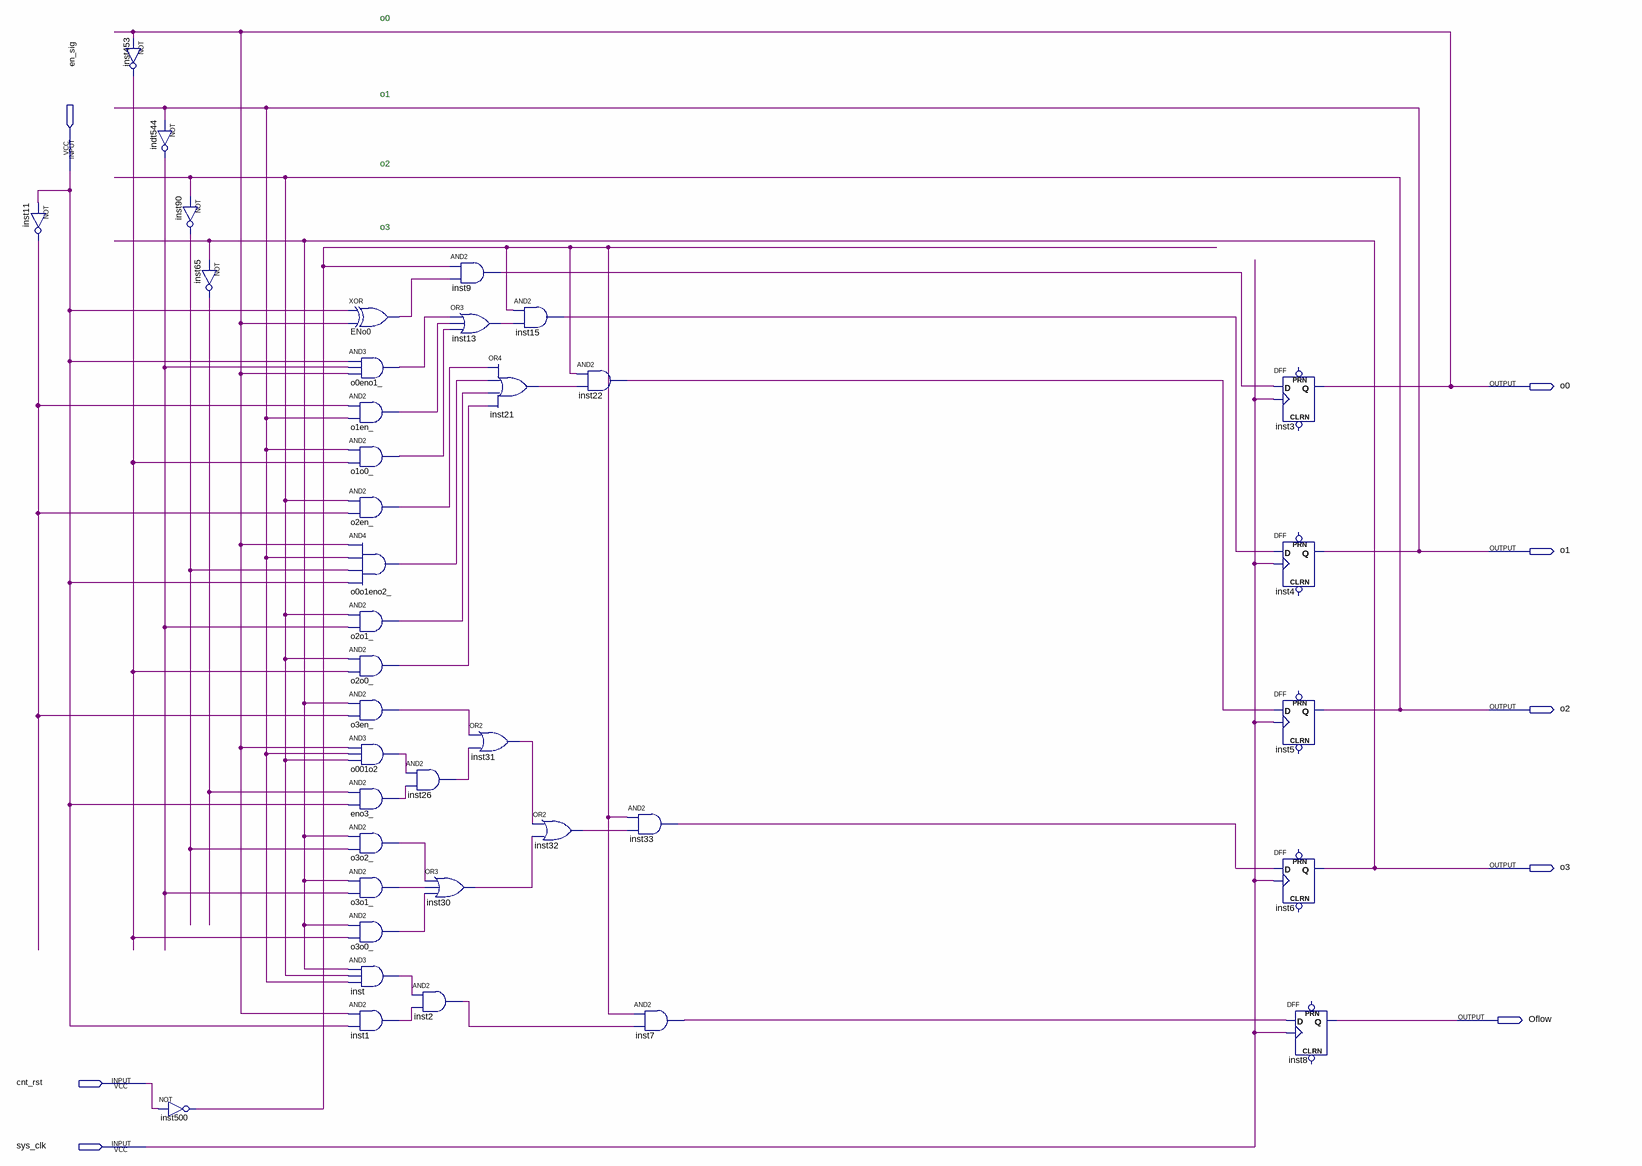
[diagram p0: schematic sheet]
// Quartus schematic counter.bdf as structural Verilog: 39 symbols, 8 pins
module counter (
  input  en_sig,
  input  cnt_rst,
  input  sys_clk,
  output o0,
  output o1,
  output o2,
  output o3,
  output Oflow
);

  wire ENo0_out, eno3__out, indt544_out, inst1_out, inst2_out, inst7_out, inst9_out, inst11_out, inst13_out,
       inst15_out, inst21_out, inst22_out, inst26_out, inst30_out, inst31_out, inst32_out, inst33_out,
       inst65_out, inst90_out, inst453_out, inst500_out, inst_out, o0eno1__out, o0o1eno2__out, o1en__out,
       o1o0__out, o001o2_out, o2en__out, o2o0__out, o2o1__out, o3en__out, o3o0__out, o3o1__out, o3o2__out;

  not inst11 (inst11_out, en_sig);
  not inst453 (inst453_out, o0);
  not indt544 (indt544_out, o1);
  not inst500 (inst500_out, cnt_rst);
  not inst90 (inst90_out, o2);
  not inst65 (inst65_out, o3);
  xor ENo0 (ENo0_out, en_sig, o0);
  and o0eno1_ (o0eno1__out, en_sig, indt544_out, o0);
  and o1en_ (o1en__out, inst11_out, o1);
  and o1o0_ (o1o0__out, o1, inst453_out);
  and o2en_ (o2en__out, o2, inst11_out);
  and o0o1eno2_ (o0o1eno2__out, o0, o1, inst90_out, en_sig);
  and o2o1_ (o2o1__out, o2, indt544_out);
  and o2o0_ (o2o0__out, o2, inst453_out);
  and o3en_ (o3en__out, o3, inst11_out);
  and o001o2 (o001o2_out, o0, o1, o2);
  and eno3_ (eno3__out, inst65_out, en_sig);
  and o3o2_ (o3o2__out, o3, inst90_out);
  and o3o1_ (o3o1__out, o3, indt544_out);
  and o3o0_ (o3o0__out, o3, inst453_out);
  and inst (inst_out, o3, o2, o1);
  and inst1 (inst1_out, o0, en_sig);
  and inst26 (inst26_out, o001o2_out, eno3__out);
  and inst2 (inst2_out, inst_out, inst1_out);
  and inst9 (inst9_out, inst500_out, ENo0_out);
  or inst13 (inst13_out, o0eno1__out, o1en__out, o1o0__out);
  or inst30 (inst30_out, o3o2__out, o3o1__out, o3o0__out);
  and inst15 (inst15_out, inst500_out, inst13_out);
  or inst21 (inst21_out, o2en__out, o0o1eno2__out, o2o1__out, o2o0__out);
  or inst31 (inst31_out, o3en__out, inst26_out);
  or inst32 (inst32_out, inst31_out, inst30_out);
  and inst22 (inst22_out, inst500_out, inst21_out);
  and inst33 (inst33_out, inst500_out, inst32_out);
  and inst7 (inst7_out, inst500_out, inst2_out);
  DFF inst3 (.CLK(sys_clk), .D(inst9_out), .Q(o0));  // open: CLRN, PRN
  DFF inst4 (.CLK(sys_clk), .D(inst15_out), .Q(o1));  // open: CLRN, PRN
  DFF inst5 (.CLK(sys_clk), .D(inst22_out), .Q(o2));  // open: CLRN, PRN
  DFF inst6 (.CLK(sys_clk), .D(inst33_out), .Q(o3));  // open: CLRN, PRN
  DFF inst8 (.CLK(sys_clk), .D(inst7_out), .Q(Oflow));  // open: CLRN, PRN

  // Notes on the sheet:
  //   o0
  //   o1
  //   o2
  //   o3
endmodule
